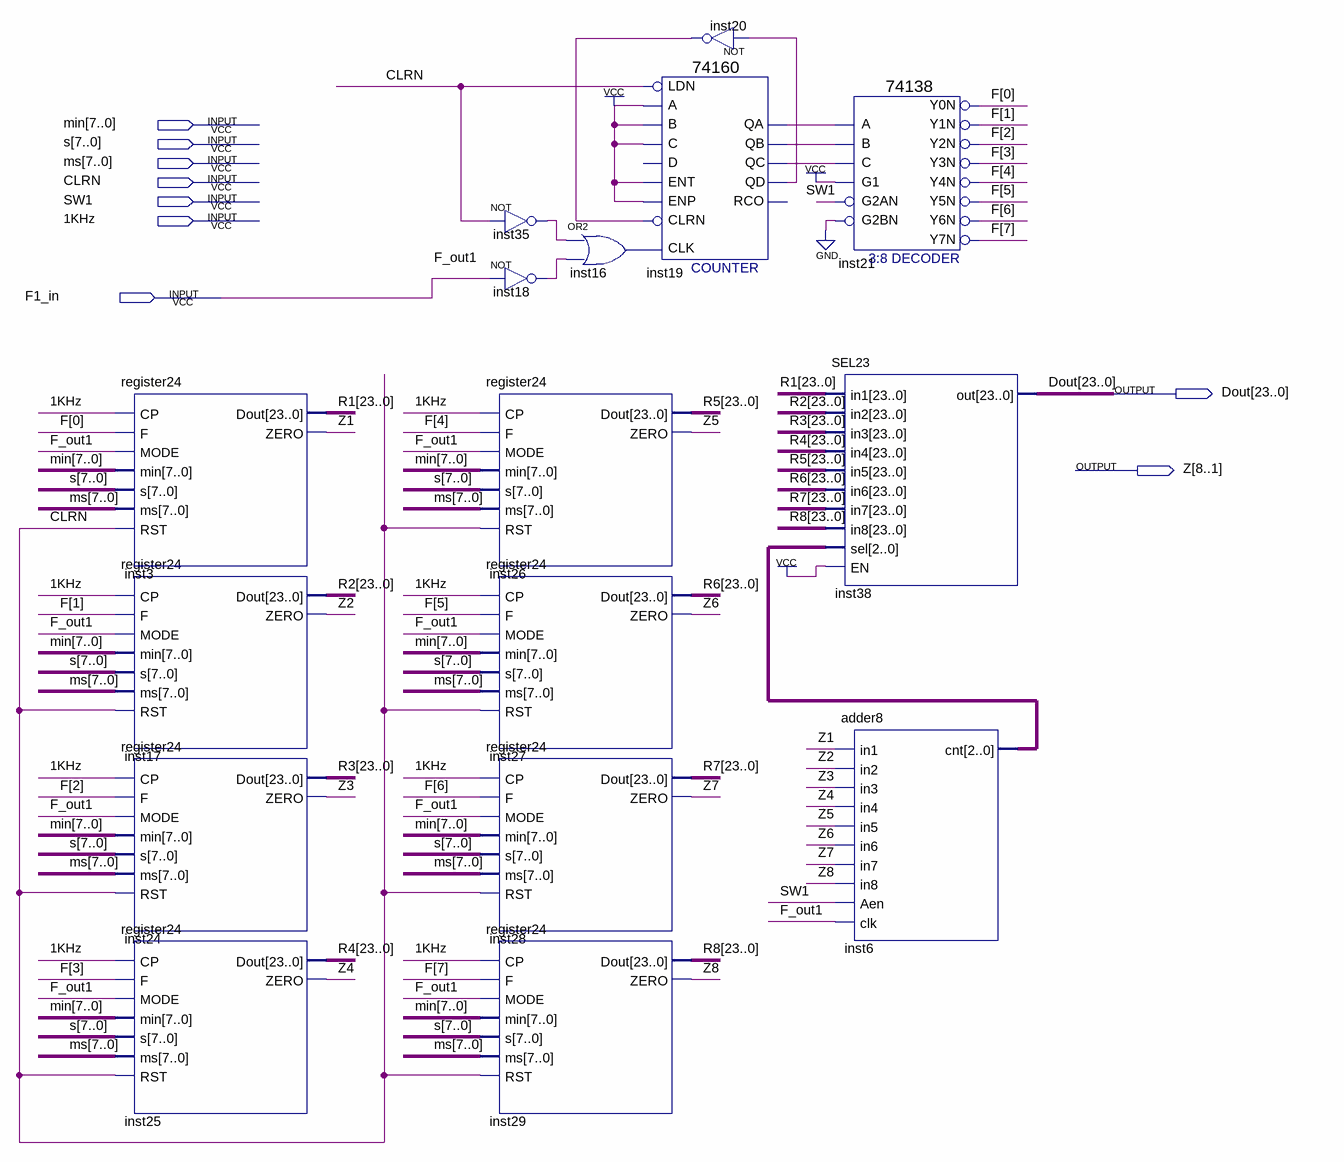
[diagram p0: schematic sheet]
// Quartus schematic register_bank.bdf as structural Verilog: 16 symbols, 9 pins
module register_bank (
  input  [7:0] min,
  input  [7:0] s,
  input  [7:0] ms,
  input  CLRN,
  input  SW1,
  input  \1KHz ,
  input  F1_in,
  output [23:0] Dout,
  output [8:1] Z
);

  wire inst16_out, inst18_out, inst19_qa, inst19_qb, inst19_qc, inst19_qd, inst20_out, inst35_out;
  wire [2:0] inst6_cnt;
  wire [7:0] F;
  wire [23:0] R1, R2, R3, R4, R5, R6, R7, R8;

  register24 inst3 (.CP(\1KHz ), .F(F[0]), .MODE(F1_in), .min(min), .s(s), .ms(ms), .RST(CLRN), .Dout(R1), .ZERO(Z[1]));
  register24 inst17 (
    .CP(\1KHz ), .F(F[1]), .MODE(F1_in), .min(min), .s(s), .ms(ms), .RST(CLRN), .Dout(R2), .ZERO(Z[2]));
  register24 inst24 (
    .CP(\1KHz ), .F(F[2]), .MODE(F1_in), .min(min), .s(s), .ms(ms), .RST(CLRN), .Dout(R3), .ZERO(Z[3]));
  register24 inst25 (
    .CP(\1KHz ), .F(F[3]), .MODE(F1_in), .min(min), .s(s), .ms(ms), .RST(CLRN), .Dout(R4), .ZERO(Z[4]));
  not inst35 (inst35_out, CLRN);
  not inst18 (inst18_out, F1_in);
  register24 inst26 (
    .CP(\1KHz ), .F(F[4]), .MODE(F1_in), .min(min), .s(s), .ms(ms), .RST(CLRN), .Dout(R5), .ZERO(Z[5]));
  register24 inst27 (
    .CP(\1KHz ), .F(F[5]), .MODE(F1_in), .min(min), .s(s), .ms(ms), .RST(CLRN), .Dout(R6), .ZERO(Z[6]));
  register24 inst28 (
    .CP(\1KHz ), .F(F[6]), .MODE(F1_in), .min(min), .s(s), .ms(ms), .RST(CLRN), .Dout(R7), .ZERO(Z[7]));
  register24 inst29 (
    .CP(\1KHz ), .F(F[7]), .MODE(F1_in), .min(min), .s(s), .ms(ms), .RST(CLRN), .Dout(R8), .ZERO(Z[8]));
  or inst16 (inst16_out, inst35_out, inst18_out);
  \74160  inst19 (
    .CLK(inst16_out), .ENT(1'b1), .A(1'b1), .B(1'b1), .C(1'b1), .LDN(CLRN), .ENP(1'b1), .CLRN(inst20_out),
    .QD(inst19_qd), .QA(inst19_qa), .QB(inst19_qb), .QC(inst19_qc));  // open: D, RCO
  not inst20 (inst20_out, inst19_qd);
  \74138  inst21 (
    .A(inst19_qa), .B(inst19_qb), .G1(1'b1), .C(inst19_qc), .G2AN(SW1), .G2BN(1'b0), .Y0N(F[0]), .Y1N(F[1]),
    .Y2N(F[2]), .Y3N(F[3]), .Y4N(F[4]), .Y5N(F[5]), .Y6N(F[6]), .Y7N(F[7]));
  SEL23 inst38 (
    .in1(R1), .in2(R2), .in3(R3), .in4(R4), .in5(R5), .in6(R6), .in7(R7), .in8(R8), .sel(inst6_cnt),
    .EN(1'b1), .out(Dout));
  adder8 inst6 (
    .in1(Z[1]), .in2(Z[2]), .in3(Z[3]), .in4(Z[4]), .in5(Z[5]), .in6(Z[6]), .in7(Z[7]), .in8(Z[8]),
    .Aen(SW1), .clk(F1_in), .cnt(inst6_cnt));

  // Other names for the same wires on the sheet: F_out1 = F1_in
endmodule
